# Altium schematic sheet GuitarPedal.SchDoc: Guitar Pedal
size A4; DrawnBy: Arman Hasanbegovic; Revision: 1; SheetNumber: 1
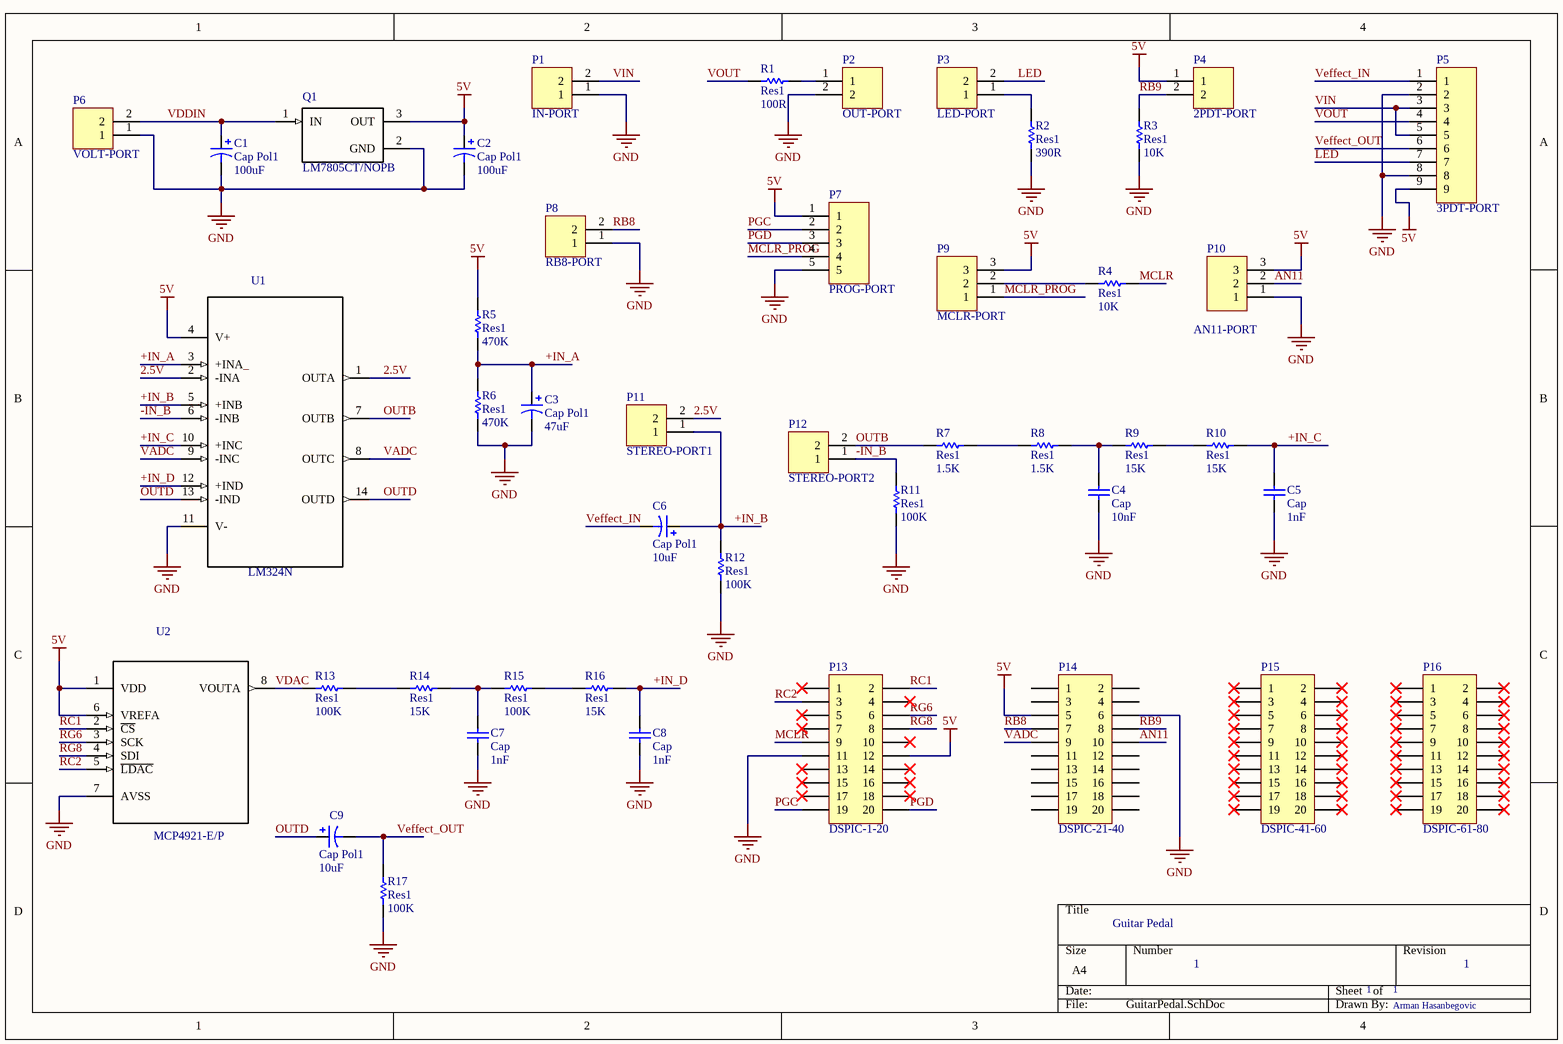
[diagram p0: GuitarPedal.SchDoc]

## Parts
C1  Cap Pol1  value 100uF  [RB7.6-15]
C2  Cap Pol1  value 100uF  [RB7.6-15]
C3  Cap Pol1  value 47uF  [RB7.6-15]
C4  Cap  value 10nF  [RAD-0.3]
C5  Cap  value 1nF  [RAD-0.3]
C6  Cap Pol1  value 10uF  [RB7.6-15]
C7  Cap  value 1nF  [RAD-0.3]
C8  Cap  value 1nF  [RAD-0.3]
C9  Cap Pol1  value 10uF  [RB7.6-15]
P1  IN-PORT  [HDR1X2]
P2  OUT-PORT  [HDR1X2]
P3  LED-PORT  [HDR1X2]
P4  2PDT-PORT  [HDR1X2]
P5  3PDT-PORT  [HDR1X9]
P6  VOLT-PORT  [HDR1X2]
P7  PROG-PORT  [HDR1X5]
P8  RB8-PORT  [HDR1X2]
P9  MCLR-PORT  [HDR1X3]
P10  AN11-PORT  [HDR1X3]
P11  STEREO-PORT1  [HDR1X2]
P12  STEREO-PORT2  [HDR1X2]
P13  DSPIC-1-20  [HDR2X10]
P14  DSPIC-21-40  [HDR2X10]
P15  DSPIC-41-60  [HDR2X10]
P16  DSPIC-61-80  [HDR2X10]
Q1  LM7805CT/NOPB  [*TO254P1054X470X2600-3]
R1  Res1  value 100R  [AXIAL-0.3]
R2  Res1  value 390R  [AXIAL-0.3]
R3  Res1  value 10K  [AXIAL-0.3]
R4  Res1  value 10K  [AXIAL-0.3]
R5  Res1  value 470K  [AXIAL-0.3]
R6  Res1  value 470K  [AXIAL-0.3]
R7  Res1  value 1.5K  [AXIAL-0.3]
R8  Res1  value 1.5K  [AXIAL-0.3]
R9  Res1  value 15K  [AXIAL-0.3]
R10  Res1  value 15K  [AXIAL-0.3]
R11  Res1  value 100K  [AXIAL-0.3]
R12  Res1  value 100K  [AXIAL-0.3]
R13  Res1  value 100K  [AXIAL-0.3]
R14  Res1  value 15K  [AXIAL-0.3]
R15  Res1  value 100K  [AXIAL-0.3]
R16  Res1  value 15K  [AXIAL-0.3]
R17  Res1  value 100K  [AXIAL-0.3]
U1  LM324N  [*DIP254P762X508-14]
U2  MCP4921-E/P  [*DIP254P762X432-8]

## Nets
5V: C2.1 P4.1 P5.9 P7.1 P9.3 P10.3 P13.12 P14.5 Q1.3(OUT) R5.2 U1.4(V+) U2.1(VDD) U2.6(VREFA)
GND: C1.2 C2.2 C3.2 C4.1 C5.1 C7.1 C8.1 P1.1 P2.2 P5.2 P5.8 P6.1 P7.5 P8.1 P10.1 P13.11 P14.6 Q1.2(GND) R2.1 R3.1 R6.1 R11.1 R12.1 R17.1 U1.11(V-) U2.7(AVSS)
2.5V: P11.2 U1.1(OUTA) U1.2(-INA)
+IN_A: C3.1 R5.1 R6.2 U1.3(+INA_)
+IN_B: C6.1 P11.1 R12.2 U1.5(+INB)
+IN_C: C5.2 R10.2 U1.10(+INC)
+IN_D: C8.2 R16.2 U1.12(+IND)
-IN_B: P12.1 R11.2 U1.6(-INB)
AN11: P10.2 P14.10
LED: P3.2 P5.7
MCLR: P13.9 R4.2
MCLR_PROG: P7.4 P9.1
OUTB: P12.2 R7.1 U1.7(OUTB)
OUTD: C9.1 U1.13(-IND) U1.14(OUTD)
PGC: P7.2 P13.19
PGD: P7.3 P13.20
RB8: P8.2 P14.7
RB9: P4.2 P14.8 R3.2
RC1: P13.2 U2.2(~{CS})
RC2: P13.3 U2.5(~{LDAC})
RG6: P13.6 U2.3(SCK)
RG8: P13.8 U2.4(SDI)
VADC: P14.9 U1.8(OUTC) U1.9(-INC)
VDAC: R13.1 U2.8(VOUTA)
VDDIN: C1.1 P6.2 Q1.1(IN)
Veffect_IN: C6.2 P5.1
Veffect_OUT: C9.2 P5.6 R17.2
VIN: P1.2 P5.3 P5.5
VOUT: P5.4 R1.1
NetC4_2: C4.2 R8.2 R9.1
NetC7_2: C7.2 R14.2 R15.1
NetP2_1: P2.1 R1.2
NetP3_1: P3.1 R2.2
NetP9_2: P9.2 R4.1
NetR7_2: R7.2 R8.1
NetR9_2: R9.2 R10.1
NetR13_2: R13.2 R14.1
NetR15_2: R15.2 R16.1

Not connected (* = marked no-connect by the designer): P13 1* 4* 5* 7* 10* 13* 14* 15* 16* 17* 18*; P14 1 2 3 4 11 12 13 14 15 16 17 18 19 20; P15 1* 2* 3* 4* 5* 6* 7* 8* 9* 10* 11* 12* 13* 14* 15* 16* 17* 18* 19* 20*; P16 1* 2* 3* 4* 5* 6* 7* 8* 9* 10* 11* 12* 13* 14* 15* 16* 17* 18* 19* 20*

## Library data of the parts
C1-C3 C6 C9 = Cap Pol1: Polarized Capacitor (Radial); Published: 8-Jun-2000; LatestRevisionDate: 17-Jul-2002; LatestRevisionNote: Re-released for DXP Platform.; PackageReference: RB7.6-15; Publisher: Altium Limited; PackageDescription: Polarized Capacitor (Radial); 2 Leads
C4 C5 C7 C8 = Cap: Capacitor; Published: 8-Jun-2000; LatestRevisionDate: 17-Jul-2002; LatestRevisionNote: Re-released for DXP Platform.; PackageReference: RAD-0.3; Publisher: Altium Limited; PackageDescription: Radial Cap, Thru-Hole; 2 Leads; 0.3 in Pin Spacing
P1-P4 P6 P8 P11 P12 = Header 2: Header, 2-Pin; LatestRevisionDate: 17-Jul-2002; LatestRevisionNote: Re-released for DXP Platform.; Publisher: Altium Limited
P5 = Header 9: Header, 9-Pin; LatestRevisionDate: 17-Jul-2002; LatestRevisionNote: Re-released for DXP Platform.; Publisher: Altium Limited
P7 = Header 5: Header, 5-Pin; LatestRevisionDate: 17-Jul-2002; LatestRevisionNote: Re-released for DXP Platform.; Publisher: Altium Limited
P9 P10 = Header 3: Header, 3-Pin; LatestRevisionDate: 17-Jul-2002; LatestRevisionNote: Re-released for DXP Platform.; Publisher: Altium Limited
P13-P16 = Header 10X2: Header, 10-Pin, Dual row; LatestRevisionDate: 17-Jul-2002; LatestRevisionNote: Re-released for DXP Platform.; Publisher: Altium Limited
Q1 = LM7805CT/NOPB: IC REG LINEAR 5V 1A TO220AB; MF: ON Semiconductor; SnapEDA_Link: https://www.snapeda.com/parts/LM7805CT/ON%20Semiconductor/view-part/?ref=snap; MP: LM7805CT; Availability: Unavailable; Price: None; Package: TO-220 ON Semiconductor; Value: *
R1-R17 = Res1: Resistor; Published: 8-Jun-2000; LatestRevisionDate: 17-Jul-2002; LatestRevisionNote: Re-released for DXP Platform.; PackageReference: AXIAL-0.3; Publisher: Altium Limited; PackageDescription: Axial Device, Thru-Hole; 2 Leads; 0.3 in Pin Spacing
U1 = LM324N: Ic Opamp Gp 1.2mhz 14dip; MF: STMicroelectronics; SnapEDA_Link: https://www.snapeda.com/parts/LM324N/STMicroelectronics/view-part/?ref=snap; Availability: Unavailable; MP: LM324N; Package: PDIP-14 Motorola; Price: None; Value: *
U2 = MCP4921-E/P: MCP4921 Series 1 Ch 12-Bit Voltage Output Digital-to-Analog Converter-PDIP-8; MF: Microchip; Digi-Key_Part_Number: MCP4921-E/P-ND; SnapEDA_Link: https://www.snapeda.com/parts/MCP4921-E/P/Microchip/view-part/?ref=snap; MP: MCP4921-E/P; Package: DIP-8 Microchip; Digi-Key_Purchase_URL: https://www.digikey.ba/product-detail/en/microchip-technology/MCP4921-E-P/MCP4921-E-P-ND/716280?utm_source=snapeda&utm_medium=aggregator&utm_campaign=symbol; Value: *